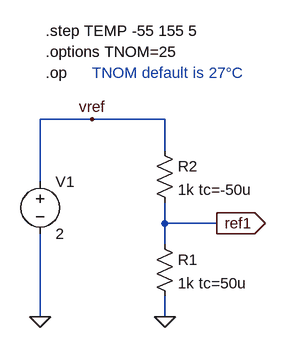
[diagram p0: schematic tc_of _res.asc]
tc_of _res.asc, the LTspice schematic file:
Version 4
SHEET 1 880 680
WIRE 96 0 16 0
WIRE 208 0 96 0
WIRE 208 48 208 0
WIRE 16 96 16 0
WIRE 208 160 208 128
WIRE 288 160 208 160
WIRE 208 192 208 160
WIRE 16 304 16 176
WIRE 208 304 208 272
FLAG 208 304 0
FLAG 16 304 0
FLAG 96 0 vref
FLAG 288 160 ref1
IOPIN 288 160 Out
SYMBOL res 192 176 R0
SYMATTR InstName R1
SYMATTR Value 1k tc=50u
SYMBOL res 192 32 R0
SYMATTR InstName R2
SYMATTR Value 1k tc=-50u
SYMBOL voltage 16 80 R0
SYMATTR InstName V1
SYMATTR Value 2
TEXT 24 -136 Left 0 !.step TEMP -55 155 5
TEXT 24 -72 Left 0 !.op
TEXT 24 -104 Left 0 !.options TNOM=25
TEXT 96 -72 Left 0 ;TNOM default is 27°C

The netlist it stands for:
* tc_of _res.asc
R1 ref1 0 1k tc=50u
R2 vref ref1 1k tc=-50u
V1 vref 0 2
.step TEMP -55 155 5
.op
.options TNOM=25
* TNOM default is 27°C
.backanno
.end